# Altium project minor project.PrjPcb
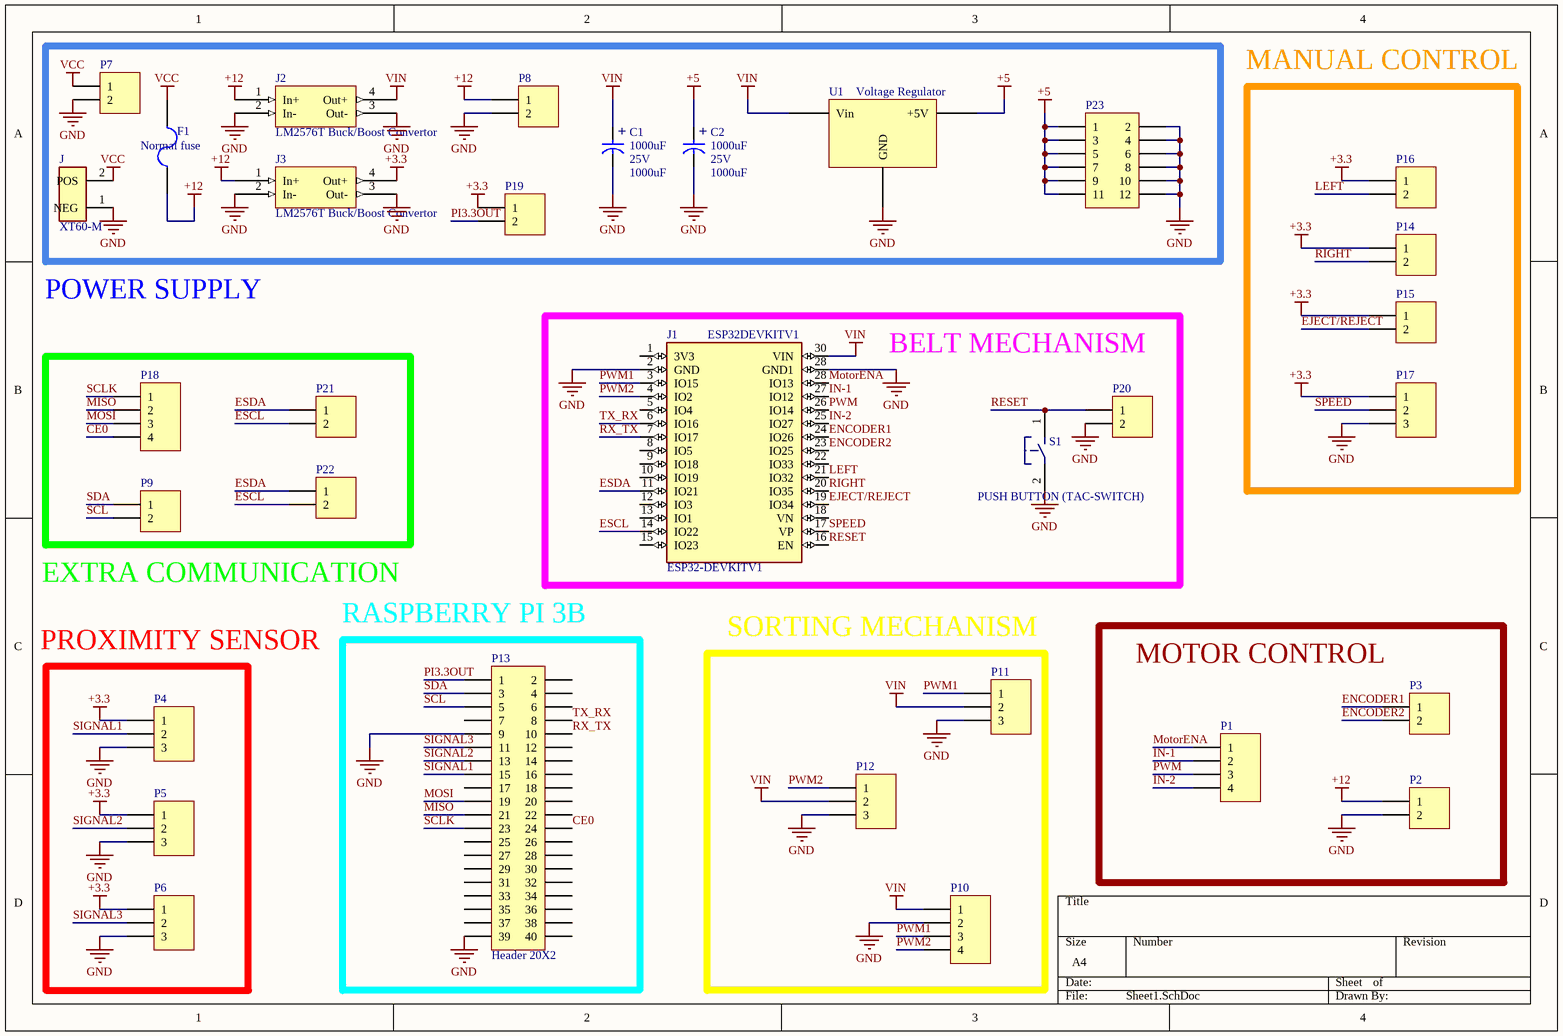
[diagram p0: Sheet1.SchDoc]
1 sheet, 32 parts. Net scope: global (net labels, ports and power ports of the same name join across sheets).
Board file: PCB1.PcbDoc

## Sheet Sheet1.SchDoc
size A4; SheetNumber: 1; SheetTotal: 1

### Parts
C1  1000uF  volt: 25V  [SELF_CAP_THT5MM]
C2  1000uF  volt: 25V  [SELF_CAP_THT5MM]
F1  Normal fuse  [MY_FUSE]
J  XT60-M  [AMASS_XT60-M]
J1  ESP32DEVKITV1  [ESP32-DEVKITV1]
J2  LM2576T Buck/Boost Convertor  [LM2596 MODULE]
J3  LM2576T Buck/Boost Convertor  [LM2596 MODULE]
P1  Header 4  [MY_6410-04]  (value not drawn)
P2  Header 2  [My_CN2]  (value not drawn)
P3  Header 2  [MY_6410-02]  (value not drawn)
P4  Header 3  [MY_6410-03]  (value not drawn)
P5  Header 3  [MY_6410-03]  (value not drawn)
P6  Header 3  [MY_6410-03]  (value not drawn)
P7  Header 2  [My_CN2]  (value not drawn)
P8  Header 2  [My_CN2]  (value not drawn)
P9  Header 2  [MY_6410-02]  (value not drawn)
P10  Header 4  [MY_6410-04]  (value not drawn)
P11  Header 3  [MY_6410-03]  (value not drawn)
P12  Header 3  [MY_6410-03]  (value not drawn)
P13  Header 20X2  [MY_2X20]
P14  Header 2  [MY_6410-02]  (value not drawn)
P15  Header 2  [MY_6410-02]  (value not drawn)
P16  Header 2  [MY_6410-02]  (value not drawn)
P17  Header 3  [MY_6410-03]  (value not drawn)
P18  Header 4  [MY_6410-04]  (value not drawn)
P19  Header 2  [My_1X02]  (value not drawn)
P20  Header 2  [MY_6410-02]  (value not drawn)
P21  Header 2  [MY_6410-02]  (value not drawn)
P22  Header 2  [MY_6410-02]  (value not drawn)
P23  Header 6X2  [My_2X06]  (value not drawn)
S1  PUSH BUTTON (TAC-SWITCH)  [SELF_TACTILE_THT]
U1  Voltage Regulator  [SELF_LM7805_THT]

### Blocks framed on the sheet
BELT MECHANISM: J1 P20 S1
MOTOR CONTROL: P1-P3

### Nets
+3.3: J3.4(Out+) P4.1 P5.1 P6.1 P14.1 P15.1 P16.1 P17.1 P19.1
+5: C2.+ P23.1 P23.3 P23.5 P23.7 P23.9 P23.11 U1.3(+5V)
+12: F1.1 J2.1(In+) J3.1(In+) P2.1 P8.1
GND: C1.- C2.- J.1(NEG) J1.2(GND) J1.28(GND1) J2.2(In-) J2.3(Out-) J3.2(In-) J3.3(Out-) P2.2 P4.3 P5.3 P6.3 P7.2 P8.2 P10.2 P11.3 P12.3 P13.9 P13.39 P17.3 P20.2 P23.2 P23.4 P23.6 P23.8 P23.10 P23.12 S1.2 U1.2(GND)
VCC: F1.2 J.2(POS) P7.1
VIN: C1.+ J1.30(VIN) J2.4(Out+) P10.1 P11.2 P12.2 U1.1(Vin)
CE0: P13.24 P18.4
EJECT/REJECT: J1.19(IO34) P15.2
ENCODER1: J1.24(IO26) P3.1
ENCODER2: J1.23(IO25) P3.2
ESCL: J1.14(IO22) P21.2 P22.2
ESDA: J1.11(IO21) P21.1 P22.1
IN-1: J1.27(IO12) P1.2
IN-2: J1.25(IO27) P1.4
LEFT: J1.21(IO32) P16.2
MISO: P13.21 P18.2
MOSI: P13.19 P18.3
MotorENA: J1.28(IO13) P1.1
PI3.3OUT: P13.1 P19.2
PWM: J1.26(IO14) P1.3
PWM1: J1.3(IO15) P10.3 P11.1
PWM2: J1.4(IO2) P10.4 P12.1
RESET: J1.16(EN) P20.1 S1.1
RIGHT: J1.20(IO35) P14.2
RX_TX: J1.7(IO17) P13.10
SCL: P9.2 P13.5
SCLK: P13.23 P18.1
SDA: P9.1 P13.3
SIGNAL1: P4.2 P13.15
SIGNAL2: P5.2 P13.13
SIGNAL3: P6.2 P13.11
SPEED: J1.17(VP) P17.2
TX_RX: J1.6(IO16) P13.8

Not connected (* = marked no-connect by the designer): J1 1(3V3) 5(IO4) 8(IO5) 9(IO18) 10(IO19) 12(IO3) 13(IO1) 15(IO23) 18(VN) 22(IO33); P13 2 4 6 7 12 14 16 17 18 20 22 25 26 27 28 29 30 31 32 33 34 35 36 37 38 40

### Notes on the sheet
- MANUAL CONTROL
- POWER SUPPLY
- EXTRA COMMUNICATION
- PROXIMITY SENSOR
- (near P13) RASPBERRY PI 3B
- SORTING MECHANISM
- (in symbol ESP32DEVKITV1) ESP32-DEVKITV1

### Library data of the parts
C1 C2 = CAPACITOR (ELECTROLYTIC): value: 1000uF
F1 = Fuse: ASiD Part Number: Fuse-AS
J = XT60-M: Plug; DC supply; XT60; male; PIN: 2; for cable; soldered; 30A; 500V; MF: AMASS; MP: XT60-M; Price: None; Package: Package Analog Devices; Value: *; Availability: Unavailable; SnapEDA_Link: https://www.snapeda.com/parts/XT60-M/AMASS/view-part/2883912/?ref=snap
J1 = ESP32DEVKITV1: Dual core, Wi-Fi: 2.4 GHz up to 150 Mbits/s,BLE (Bluetooth Low Energy) and legacy Bluetooth, 32 bits, Up to 240 MHz; MF: Do it; Availability: No availability data; MP: ESP32 DEVKIT V1; SnapEDA_Link: https://www.snapeda.com/parts/ESP32%20DEVKIT%20V1/Do%20it/view-part/5659245/?ref=snap; Value: *; Price: None; Check_prices: https://www.snapeda.com/parts/ESP32%20DEVKIT%20V1/Do%20it/view-part/5659245/?ref=eda; Package: Package
P1 = Header 4: motor driver control pin; ASiD Part Number: Header 4-AS
P2 = Header 2: motor driver power; ASiD Part Number: Header 2-AS
P3 = Header 2: motor encoder; ASiD Part Number: Header 2-AS
P4 = Header 3: PROXIMITY SENSOR 1; ASiD Part Number: Header 3-AS
P5 = Header 3: PROXIMITY SENSOR 2; ASiD Part Number: Header 3-AS
P6 = Header 3: PROXIMITY SENSOR 3; ASiD Part Number: Header 3-AS
P7 = Header 2: power in; ASiD Part Number: Header 2-AS
P8 = Header 2: led supply; ASiD Part Number: Header 2-AS
P9 = Header 2: i2c port for future use.Raspberry pi 2b.; ASiD Part Number: Header 2-AS
P10 = Header 4: SORTING MECHANISM for uln2003; ASiD Part Number: Header 4-AS
P11 = Header 3: SORTING MECHANISM -servo motor 1; ASiD Part Number: Header 3-AS
P12 = Header 3: SORTING MECHANISM -servo motor 2; ASiD Part Number: Header 3-AS
P13 = Header 20X2: rasbery pi 2 b connector; ASiD Part Number: Header 20X2-AS
P14 = Header 2: manual control switch2; ASiD Part Number: Header 2-AS
P15 = Header 2: manual control switch3; ASiD Part Number: Header 2-AS
P16 = Header 2: manual control switch1; ASiD Part Number: Header 2-AS
P17 = Header 3: manual control - speed; ASiD Part Number: Header 3-AS
P18 = Header 4: SPI for future use. raspberry pi 2b; ASiD Part Number: Header 4-AS
P19 = Header 2: selection of pi 3.3v power out; ASiD Part Number: Header 2-AS
P20 = Header 2: EXTERNAL RESET; ASiD Part Number: Header 2-AS
P21 = Header 2: I2C of esp32 port 1; ASiD Part Number: Header 2-AS
P22 = Header 2: I2C of esp32 port 2; ASiD Part Number: Header 2-AS
P23 = Header 6X2: Header, 12-Pin, Dual row; ASiD Part Number: Header 6X2-AS
U1 = LM7805: +5v voltage regulator